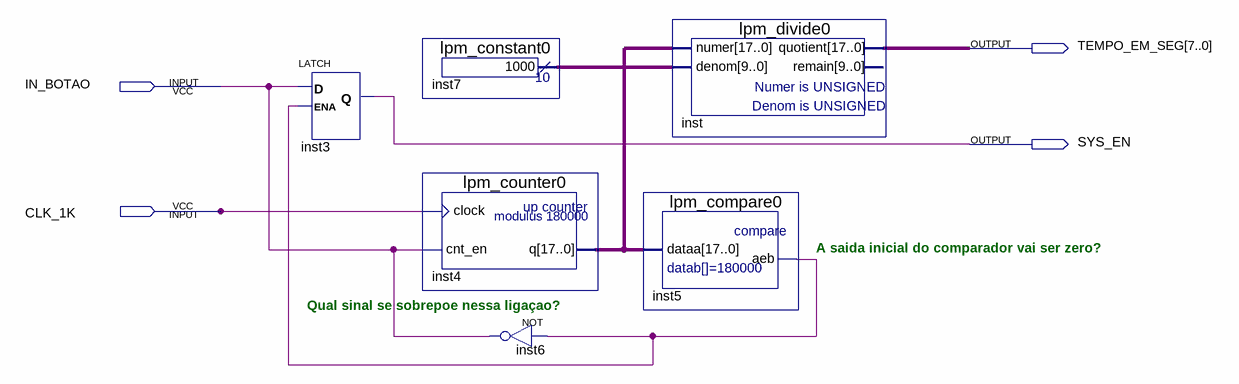
[diagram p0: schematic sheet]
// Quartus schematic contador_180s.bdf as structural Verilog: 6 symbols, 4 pins
module contador_180s (
  input  IN_BOTAO,
  input  CLK_1K,
  output [7:0] TEMPO_EM_SEG,
  output SYS_EN
);

  wire inst5_aeb;
  wire [9:0] inst7_result;
  wire [17:0] inst4_q;

  LATCH inst3 (.D(IN_BOTAO), .ENA(inst5_aeb), .Q(SYS_EN));
  lpm_constant0 inst7 (.result(inst7_result));
  lpm_counter0 inst4 (.clock(CLK_1K), .cnt_en(IN_BOTAO), .q(inst4_q));
  not inst6 (IN_BOTAO, inst5_aeb);
  lpm_divide0 inst (.numer(inst4_q), .denom(inst7_result), .quotient(TEMPO_EM_SEG));  // open: remain
  lpm_compare0 inst5 (.dataa(inst4_q), .aeb(inst5_aeb));

  // Notes on the sheet:
  //   A saida inicial do comparador vai ser zero?
  //   Qual sinal se sobrepoe nessa ligaçao?
endmodule
